# EAGLE schematic Input Sequencer Thing (EAGLE 9.4.2)
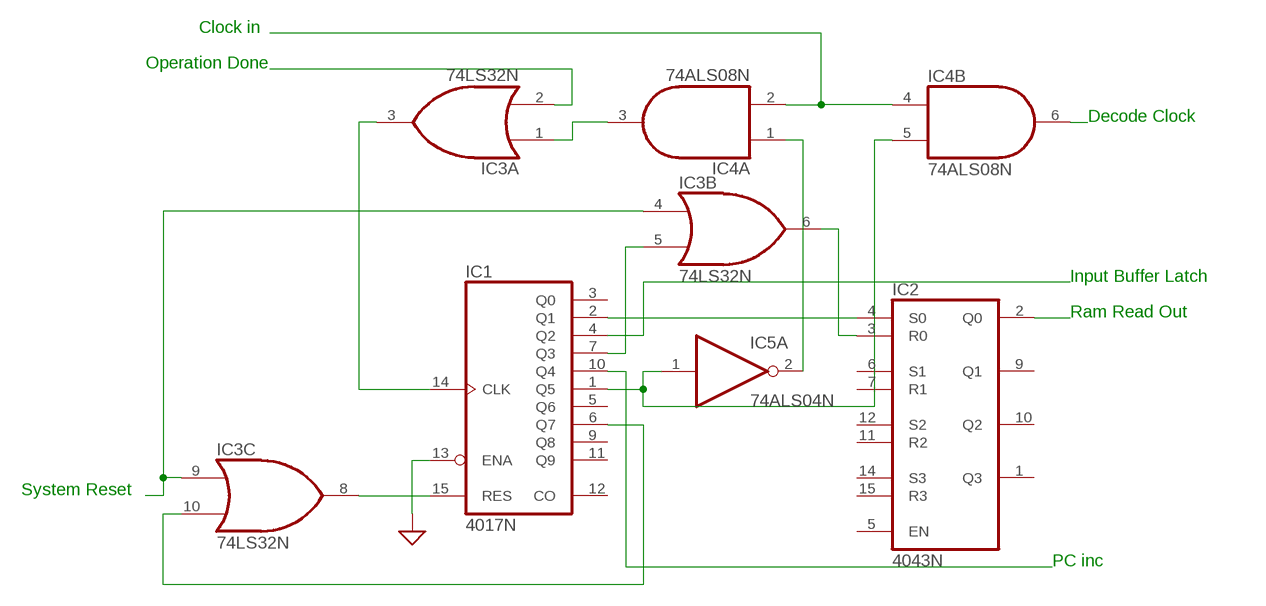
[diagram p0: schematic, sheet 1]

## Parts
IC1  4017N  [DIL16]
IC2  4043N  [DIL16]
IC3  74LS32N  [DIL14]
IC4  74ALS08N  [DIL14]
IC5  74ALS04N  [DIL14]

## Nets
GND: IC1.13(ENA) ; supply symbol labelled SUP
N$1: IC3.4(B:I0) IC3.9(C:I0)
N$2: IC1.2(Q1) IC2.4(S0)
N$3: IC2.3(R0) IC3.6(B:O)
N$4: IC2.2(Q0)
N$5: IC1.7(Q3) IC3.5(B:I1)
N$6: IC1.1(Q5) IC4.5(B:I1) IC5.1(A:I)
N$7: IC4.1(A:I0) IC5.2(A:O)
N$8: IC3.1(A:I0) IC4.3(A:O)
N$9: IC1.14(CLK) IC3.3(A:O)
N$10: IC4.2(A:I1) IC4.4(B:I0)
N$11: IC3.2(A:I1)
N$12: IC1.10(Q4)
N$13: IC4.6(B:O)
N$14: IC1.15(RES) IC3.8(C:O)
N$16: IC1.4(Q2)
N$17: IC1.6(Q7) IC3.10(C:I1)
Unconnected: IC1.3(Q0) IC1.5(Q6) IC1.9(Q8) IC1.11(Q9) IC1.12(CO) IC2.1(Q3) IC2.5(EN) IC2.6(S1) IC2.7(R1) IC2.9(Q1) IC2.10(Q2) IC2.11(R2) IC2.12(S2) IC2.14(S3) IC2.15(R3) IC3.11(D:O) IC3.12(D:I0) IC3.13(D:I1) IC4.8(C:O) IC4.9(C:I0) IC4.10(C:I1) IC4.11(D:O) IC4.12(D:I0) IC4.13(D:I1) IC5.3(B:I) IC5.4(B:O) IC5.5(C:I) IC5.6(C:O) IC5.8(D:O) IC5.9(D:I) IC5.10(E:O) IC5.11(E:I) IC5.12(F:O) IC5.13(F:I)

## Notes on the sheet
- Clock in
- Operation Done
- Decode Clock
- Input Buffer Latch
- Ram Read Out
- System Reset
- PC inc

## Power pins joined to a net without a drawn wire
GND: IC3.7(P:GND) IC4.7(P:GND) IC5.7(P:GND)
VCC: IC3.14(P:VCC) IC4.14(P:VCC) IC5.14(P:VCC)
VDD: IC1.16(VDD) IC2.16(VDD)
VSS: IC1.8(VSS) IC2.8(VSS)

## Library data of the parts
IC1 = 40xx:4017: COUNTER/DIVIDER
IC2 = 40xx:4043: Quad 3-state NOR R/S LATCH
IC3 = 74xx-us:74*32: Quad 2-input OR gate
IC4 = 74xx-us:74*08: Quad 2-input AND gate
IC5 = 74xx-us:74*04: Hex INVERTER